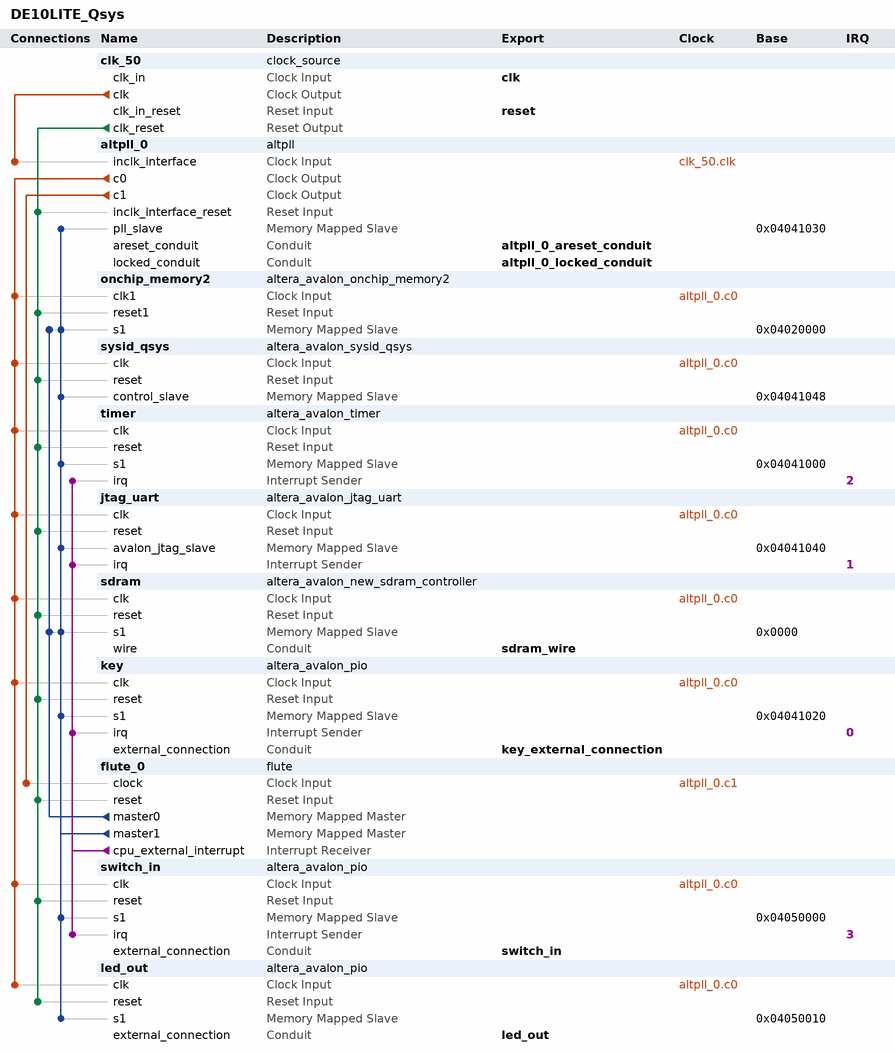
[diagram p0: system contents]
# Platform Designer (Qsys) system DE10LITE_Qsys, MAX 10 10M50DAF484C7G
# Parameters at their usual value, and those the tool derives, are not listed.
package require -exact qsys 18.1
create_system DE10LITE_Qsys
set_project_property DEVICE_FAMILY {MAX 10}
set_project_property DEVICE 10M50DAF484C7G

add_instance clk_50 clock_source 18.1
set_instance_parameter_value clk_50 clockFrequency 50000000

add_instance altpll_0 altpll 18.1
set_instance_parameter_value altpll_0 CLK0_DIVIDE_BY 1
set_instance_parameter_value altpll_0 CLK0_MULTIPLY_BY 2
set_instance_parameter_value altpll_0 CLK1_DIVIDE_BY 2
set_instance_parameter_value altpll_0 CLK1_DUTY_CYCLE 50
set_instance_parameter_value altpll_0 CLK1_MULTIPLY_BY 1
set_instance_parameter_value altpll_0 CLK1_PHASE_SHIFT -3000
set_instance_parameter_value altpll_0 INCLK0_INPUT_FREQUENCY 20000
set_instance_parameter_value altpll_0 PORT_ARESET PORT_USED
set_instance_parameter_value altpll_0 PORT_LOCKED PORT_USED
set_instance_parameter_value altpll_0 PORT_clk1 PORT_USED
set_instance_parameter_value altpll_0 PORT_clk2 PORT_UNUSED
set_instance_parameter_value altpll_0 PORT_clk3 PORT_UNUSED

add_instance onchip_memory2 altera_avalon_onchip_memory2 18.1
set_instance_parameter_value onchip_memory2 dataWidth 32
set_instance_parameter_value onchip_memory2 dualPort false
set_instance_parameter_value onchip_memory2 initMemContent true
set_instance_parameter_value onchip_memory2 initializationFileName ../software/mem.hex
set_instance_parameter_value onchip_memory2 memorySize 100000
set_instance_parameter_value onchip_memory2 useNonDefaultInitFile true

add_instance sysid_qsys altera_avalon_sysid_qsys 18.1
set_instance_parameter_value sysid_qsys id 0

add_instance timer altera_avalon_timer 18.1
set_instance_parameter_value timer period 1
set_instance_parameter_value timer periodUnits MSEC

add_instance jtag_uart altera_avalon_jtag_uart 18.1
set_instance_parameter_value jtag_uart simInteractiveOptions NO_INTERACTIVE_WINDOWS

add_instance sdram altera_avalon_new_sdram_controller 18.1
set_instance_parameter_value sdram TAC 5.4
set_instance_parameter_value sdram TRCD 15.0
set_instance_parameter_value sdram TRP 15.0
set_instance_parameter_value sdram casLatency 3
set_instance_parameter_value sdram columnWidth 10
set_instance_parameter_value sdram dataWidth 16
set_instance_parameter_value sdram generateSimulationModel true
set_instance_parameter_value sdram model single_Micron_MT48LC4M32B2_7_chip
set_instance_parameter_value sdram numberOfBanks 4
set_instance_parameter_value sdram numberOfChipSelects 1
set_instance_parameter_value sdram powerUpDelay 100.0
set_instance_parameter_value sdram refreshPeriod 7.8125
set_instance_parameter_value sdram rowWidth 13

add_instance key altera_avalon_pio 18.1
set_instance_parameter_value key captureEdge true
set_instance_parameter_value key direction Input
set_instance_parameter_value key edgeType FALLING
set_instance_parameter_value key generateIRQ true
set_instance_parameter_value key irqType EDGE
set_instance_parameter_value key width 4

add_instance flute_0 flute 1.0

add_instance switch_in altera_avalon_pio 18.1
set_instance_parameter_value switch_in captureEdge true
set_instance_parameter_value switch_in direction Input
set_instance_parameter_value switch_in generateIRQ true
set_instance_parameter_value switch_in irqType EDGE
set_instance_parameter_value switch_in width 10

add_instance led_out altera_avalon_pio 18.1
set_instance_parameter_value led_out direction Output
set_instance_parameter_value led_out width 10

# connections
add_connection altpll_0.c0 jtag_uart.clk clock
add_connection altpll_0.c0 key.clk clock
add_connection altpll_0.c0 led_out.clk clock
add_connection altpll_0.c0 onchip_memory2.clk1 clock
add_connection altpll_0.c0 sdram.clk clock
add_connection altpll_0.c0 switch_in.clk clock
add_connection altpll_0.c0 sysid_qsys.clk clock
add_connection altpll_0.c0 timer.clk clock
add_connection altpll_0.c1 flute_0.clock clock
add_connection clk_50.clk altpll_0.inclk_interface clock
add_connection clk_50.clk_reset altpll_0.inclk_interface_reset reset
add_connection clk_50.clk_reset flute_0.reset reset
add_connection clk_50.clk_reset jtag_uart.reset reset
add_connection clk_50.clk_reset key.reset reset
add_connection clk_50.clk_reset led_out.reset reset
add_connection clk_50.clk_reset onchip_memory2.reset1 reset
add_connection clk_50.clk_reset sdram.reset reset
add_connection clk_50.clk_reset switch_in.reset reset
add_connection clk_50.clk_reset sysid_qsys.reset reset
add_connection clk_50.clk_reset timer.reset reset
add_connection flute_0.master0 onchip_memory2.s1 avalon
set_connection_parameter_value flute_0.master0/onchip_memory2.s1 baseAddress 0x04020000
add_connection flute_0.master0 sdram.s1 avalon
set_connection_parameter_value flute_0.master0/sdram.s1 baseAddress 0x0000
add_connection flute_0.master1 altpll_0.pll_slave avalon
set_connection_parameter_value flute_0.master1/altpll_0.pll_slave baseAddress 0x04041030
add_connection flute_0.master1 jtag_uart.avalon_jtag_slave avalon
set_connection_parameter_value flute_0.master1/jtag_uart.avalon_jtag_slave baseAddress 0x04041040
add_connection flute_0.master1 key.s1 avalon
set_connection_parameter_value flute_0.master1/key.s1 baseAddress 0x04041020
add_connection flute_0.master1 led_out.s1 avalon
set_connection_parameter_value flute_0.master1/led_out.s1 baseAddress 0x04050010
add_connection flute_0.master1 onchip_memory2.s1 avalon
set_connection_parameter_value flute_0.master1/onchip_memory2.s1 baseAddress 0x04020000
add_connection flute_0.master1 sdram.s1 avalon
set_connection_parameter_value flute_0.master1/sdram.s1 baseAddress 0x0000
add_connection flute_0.master1 switch_in.s1 avalon
set_connection_parameter_value flute_0.master1/switch_in.s1 baseAddress 0x04050000
add_connection flute_0.master1 sysid_qsys.control_slave avalon
set_connection_parameter_value flute_0.master1/sysid_qsys.control_slave baseAddress 0x04041048
add_connection flute_0.master1 timer.s1 avalon
set_connection_parameter_value flute_0.master1/timer.s1 baseAddress 0x04041000
add_connection flute_0.cpu_external_interrupt jtag_uart.irq interrupt
set_connection_parameter_value flute_0.cpu_external_interrupt/jtag_uart.irq irqNumber 1
add_connection flute_0.cpu_external_interrupt key.irq interrupt
set_connection_parameter_value flute_0.cpu_external_interrupt/key.irq irqNumber 0
add_connection flute_0.cpu_external_interrupt switch_in.irq interrupt
set_connection_parameter_value flute_0.cpu_external_interrupt/switch_in.irq irqNumber 3
add_connection flute_0.cpu_external_interrupt timer.irq interrupt
set_connection_parameter_value flute_0.cpu_external_interrupt/timer.irq irqNumber 2

# exported interfaces
add_interface altpll_0_areset_conduit conduit end
set_interface_property altpll_0_areset_conduit EXPORT_OF altpll_0.areset_conduit
add_interface altpll_0_locked_conduit conduit end
set_interface_property altpll_0_locked_conduit EXPORT_OF altpll_0.locked_conduit
add_interface clk clock sink
set_interface_property clk EXPORT_OF clk_50.clk_in
add_interface key_external_connection conduit end
set_interface_property key_external_connection EXPORT_OF key.external_connection
add_interface led_out conduit end
set_interface_property led_out EXPORT_OF led_out.external_connection
add_interface reset reset sink
set_interface_property reset EXPORT_OF clk_50.clk_in_reset
add_interface sdram_wire conduit end
set_interface_property sdram_wire EXPORT_OF sdram.wire
add_interface switch_in conduit end
set_interface_property switch_in EXPORT_OF switch_in.external_connection

set_interconnect_requirement {$system} qsys_mm.clockCrossingAdapter HANDSHAKE
set_interconnect_requirement {$system} qsys_mm.maxAdditionalLatency 1

save_system DE10LITE_Qsys.qsys
